# Altium schematic sheet Sheet1.SchDoc
size A4; SheetNumber: 1; SheetTotal: 1
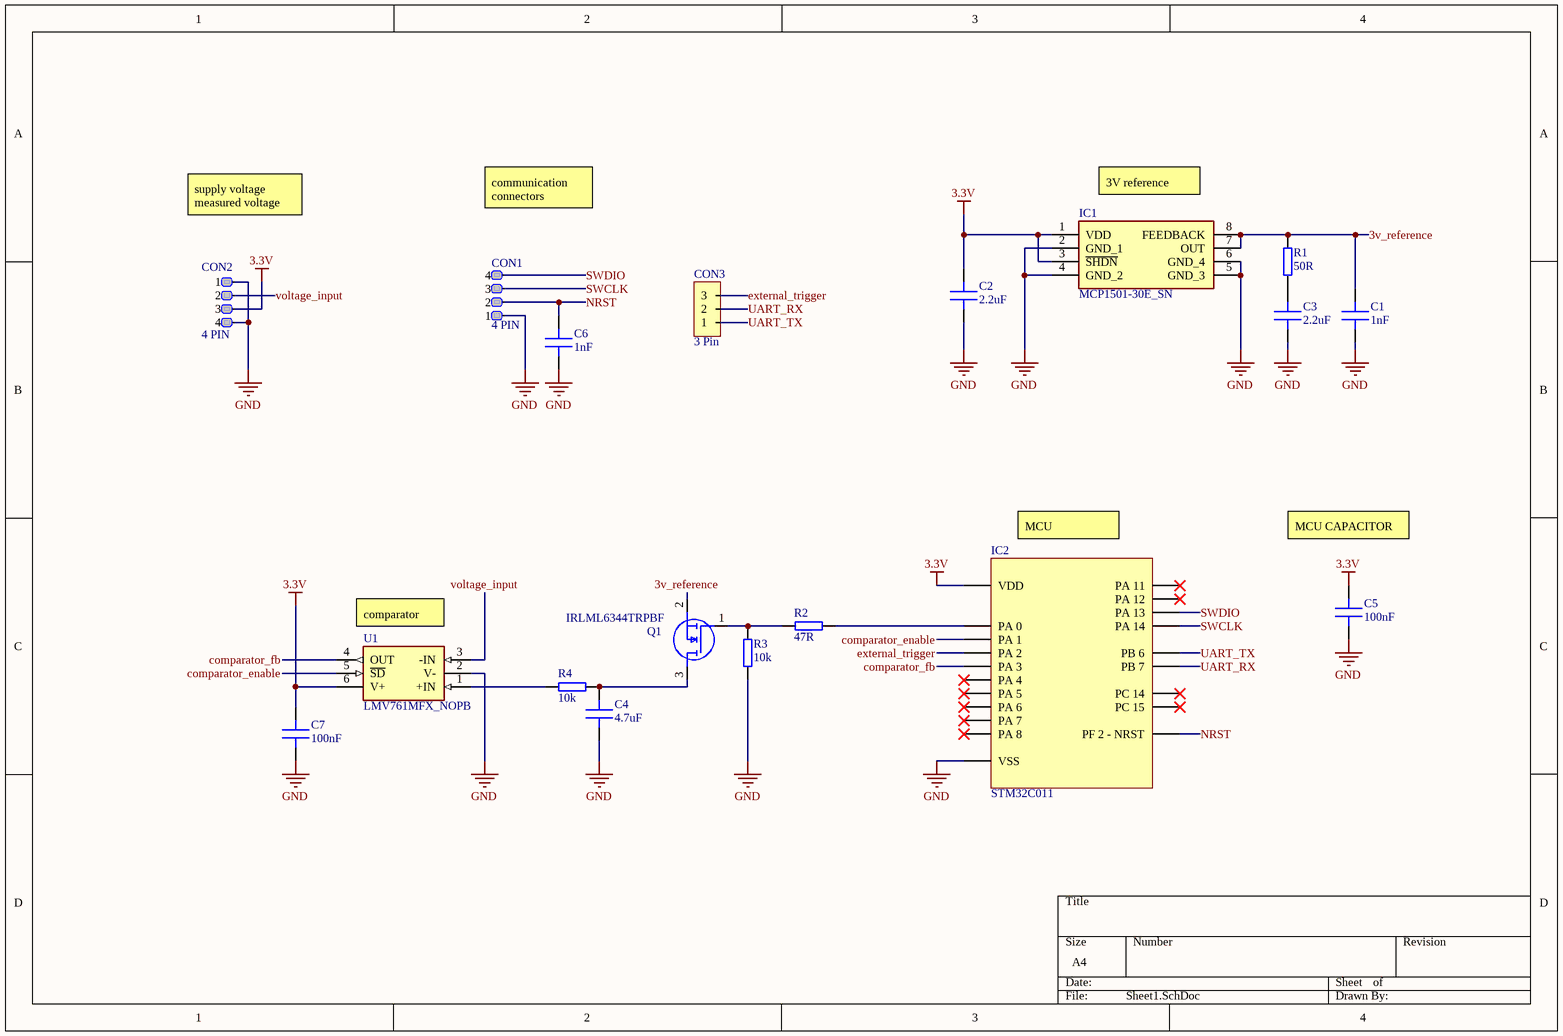
[diagram p0: Sheet1.SchDoc]

## Parts
C1  1nF  [C 0402]
C2  2.2uF  [C 0402]
C3  2.2uF  [C 0402]
C4  4.7uF  [C 0402]
C5  100nF  [C 0402]
C6  1nF  [C 0402]
C7  100nF  [C 0402]
CON1  4 PIN  [Goldpin 2.54 4P]
CON2  4 PIN  [Goldpin 2.54 4P]
CON3  3 Pin  [Goldpin 2.54 3P]
IC1  MCP1501-30E_SN  [SOIC127P600X175-8N]
IC2  STM32C011  [20-UFQFPN]
Q1  IRLML6344TRPBF  [SOT95P237X112-3N]
R1  50R  [R 0402]
R2  47R  [R 0402]
R3  10k  [R 0402]
R4  10k  [R 0402]
U1  LMV761MFX_NOPB  [SOT95P280X145-6N]

## Nets
3.3V: C2.1 C5.1 C7.1 CON2.3 IC1.1(VDD) IC1.3(~{SHDN}) IC2.2(VDD) U1.6(V+)
GND: C1.2 C2.2 C3.2 C4.2 C5.2 C6.2 C7.2 CON1.1 CON2.1 CON2.4 IC1.2(GND_1) IC1.4(GND_2) IC1.5(GND_3) IC1.6(GND_4) IC2.3(VSS) R3.1 U1.2(V-)
3v_reference: C1.1 IC1.7(OUT) IC1.8(FEEDBACK) Q1.2(S) R1.2
comparator_enable: IC2.6(PA_1) U1.5(~{SD})
comparator_fb: IC2.8(PA_3) U1.4(OUT)
external_trigger: CON3.3 IC2.7(PA_2)
NRST: C6.1 CON1.2 IC2.4(PF_2_-_NRST)
SWCLK: CON1.3 IC2.17(PA_14)
SWDIO: CON1.4 IC2.16(PA_13)
UART_RX: CON3.2 IC2.19(PB_7)
UART_TX: CON3.1 IC2.18(PB_6)
voltage_input: CON2.2 U1.3(-IN)
NetC3_1: C3.1 R1.1
NetC4_1: C4.1 Q1.3(D) R4.2
NetIC2_5: IC2.5(PA_0) R2.1
NetQ1_1: Q1.1(G) R2.2 R3.2
NetR4_1: R4.1 U1.1(+IN)

Not connected (* = marked no-connect by the designer): IC2 1(PC_15)* 9(PA_4)* 10(PA_5)* 11(PA_6)* 12(PA_7)* 13(PA_8)* 14(PA_11)* 15(PA_12)* 20(PC_14)*

## Notes on the sheet
- supply voltage measured voltage
- communication connectors
- (near IC1) 3V reference
- (near IC2) MCU
- MCU CAPACITOR
- (near U1) comparator

## Library data of the parts
C1-C7 = Capacitor: MLCC Capacitor
IC1 = MCP1501-30E_SN: Integrated Circuit; Manufacturer_Name: Microchip; Manufacturer_Part_Number: MCP1501-30E/SN; Datasheet Link: http://ww1.microchip.com/downloads/en/DeviceDoc/20005474E.pdf; Height: 1.75mm; Mouser Part Number: 579-MCP1501-30E/SN; Mouser Price/Stock: https://www.mouser.co.uk/ProductDetail/Microchip-Technology/MCP1501-30E-SN?qs=BA62vJVifGo5%252B6Z65Dge2g%3D%3D; Arrow Part Number: MCP1501-30E/SN; Arrow Price/Stock: https://www.arrow.com/en/products/mcp1501-30esn/microchip-technology?utm_currency=USD&region=nac
IC2 = STM32C011F4U: UFQFPN 20
Q1 = IRLML6344TRPBF: MOSFET (N-Channel); Manufacturer_Name: Infineon; Datasheet Link: https://www.infineon.com/dgdl/irlml6344pbf.pdf?fileId=5546d462533600a4015356689c44262c; Height: 1.12mm; Manufacturer_Part_Number: IRLML6344TRPBF; Mouser Part Number: 942-IRLML6344TRPBF; Mouser Price/Stock: https://www.mouser.co.uk/ProductDetail/Infineon-Technologies/IRLML6344TRPBF?qs=9%252BKlkBgLFf2w4qS48UOXVw%3D%3D; Arrow Part Number: IRLML6344TRPBF; Arrow Price/Stock: https://www.arrow.com/en/products/irlml6344trpbf/infineon-technologies-ag?utm_currency=USD&region=nac
R1-R4 = Resistor: General pourpouse resistor
U1 = LMV761MFX_NOPB: Undefined or Miscellaneous; Manufacturer_Name: Texas Instruments; Manufacturer_Part_Number: LMV761MFX/NOPB; Datasheet Link: http://www.ti.com/lit/gpn/lmv761; Height: 1.45mm; Mouser Part Number: 926-LMV761MFX/NOPB; Mouser Price/Stock: https://www.mouser.co.uk/ProductDetail/Texas-Instruments/LMV761MFX-NOPB?qs=7lkVKPoqpbaXVbo0E6mk2g%3D%3D; Arrow Part Number: LMV761MFX/NOPB; Arrow Price/Stock: https://www.arrow.com/en/products/lmv761mfxnopb/texas-instruments?region=nac